# EAGLE design Squirco Logic v1.0 (EAGLE 6.5.0)
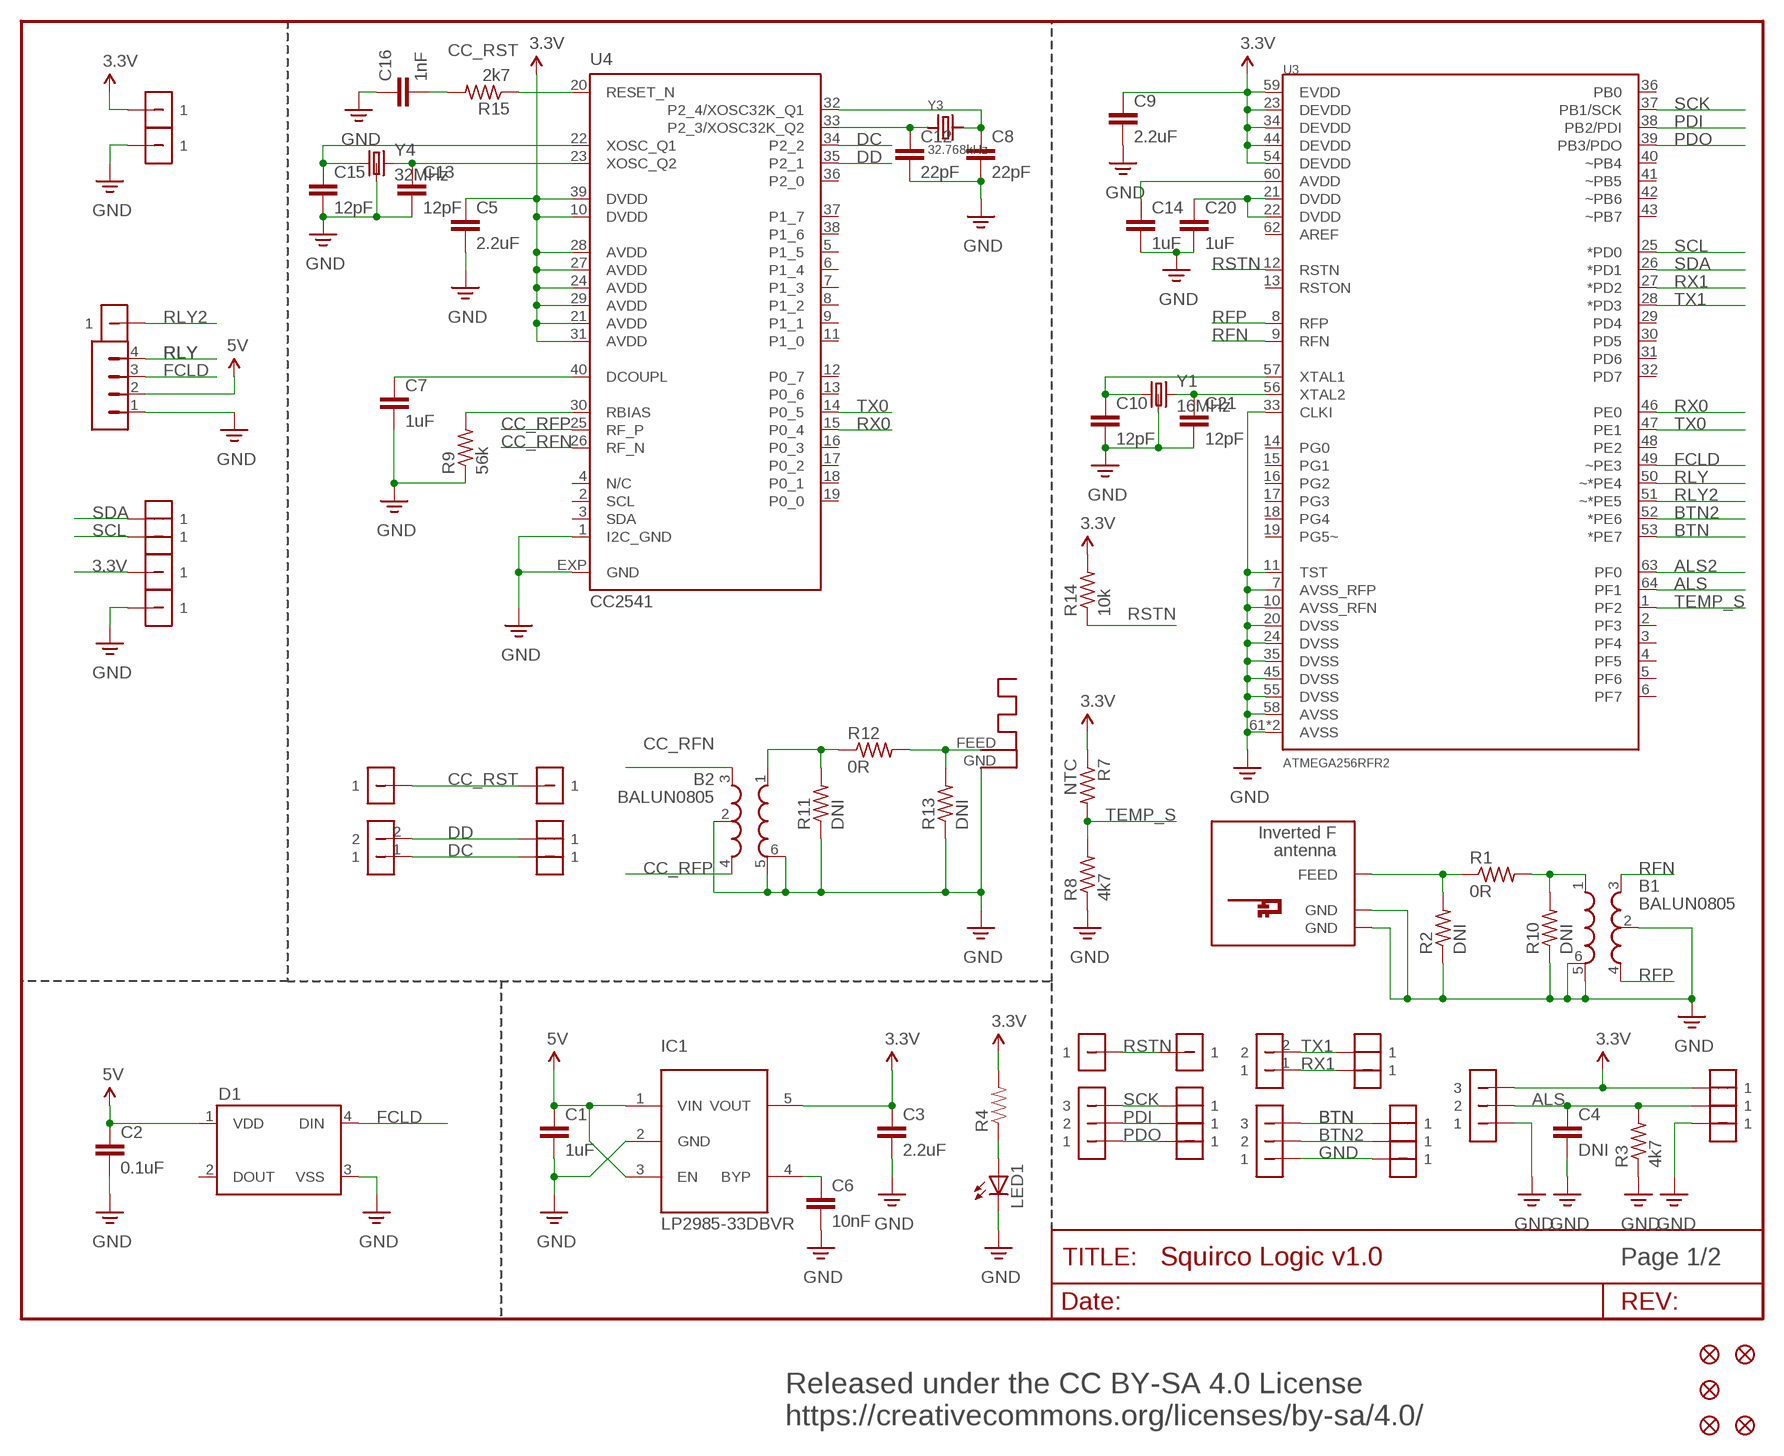
[diagram p0: schematic, sheet 1]

## Parts
ANT1  ANTENNA  [RN-ANT]
ANT2  INVERTED_F_ANTENNA+5  [DN007+5]
B1  BALUN0805  [BALUN-2-4GHZ]
B2  BALUN0805  [BALUN-2-4GHZ]
C1  1uF  CAP0603-CAP  [0603-CAP]
C2  0.1uF  CAP0603-CAP  [0603-CAP]
C3  2.2uF  CAP0603-CAP  [0603-CAP]
C4  DNI  CAP0603-CAP  [0603-CAP]
C5  2.2uF  CAP0603-CAP  [0603-CAP]
C6  10nF  CAP0603-CAP  [0603-CAP]
C7  1uF  CAP0603-CAP  [0603-CAP]
C8  22pF  CAP0402-CAP  [0402-CAP]
C9  2.2uF  CAP0603-CAP  [0603-CAP]
C10  12pF  CAP0402-CAP  [0402-CAP]
C12  22pF  CAP0402-CAP  [0402-CAP]
C13  12pF  CAP0402-CAP  [0402-CAP]
C14  1uF  CAP0603-CAP  [0603-CAP]
C15  12pF  CAP0402-CAP  [0402-CAP]
C16  1nF  CAP0603-CAP  [0603-CAP]
C20  1uF  CAP0603-CAP  [0603-CAP]
C21  12pF  CAP0402-CAP  [0402-CAP]
D1  WS2812B  [WS2812B]
FID1  FIDUCIALUFIDUCIAL  [MICRO-FIDUCIAL]
FID2  FIDUCIALUFIDUCIAL  [MICRO-FIDUCIAL]
FID3  FIDUCIALUFIDUCIAL  [MICRO-FIDUCIAL]
FID5  FIDUCIALUFIDUCIAL  [MICRO-FIDUCIAL]
FID6  FIDUCIALUFIDUCIAL  [MICRO-FIDUCIAL]
IC1  LP2985-33DBVR  LP298XS  [SOT23-5L]
JP1  M02  [M02]
LED1  LEDCHIP-LED0805  [CHIP-LED0805]
R1  0R  R-US_R0402  [R0402]
R2  DNI  R-US_R0402  [R0402]
R3  4k7  R-US_R0603  [R0603]
R4  RESISTOR0603  [0603-RES]
R7  NTC  R-US_R0402  [R0402]
R8  4k7  R-US_R0603  [R0603]
R9  56k  R-US_R0603  [R0603]
R10  DNI  R-US_R0402  [R0402]
R11  DNI  R-US_R0402  [R0402]
R12  0R  R-US_R0402  [R0402]
R13  DNI  R-US_R0402  [R0402]
R14  10k  R-US_R0603  [R0603]
R15  2k7  R-US_R0603  [R0603]
U3  ATMEGA256RFR2  [QFN-64]
U4  CC2541  [RHA_S-PVQFN-N40]
U$4  M03  [M03]
U$5  S04-4MM  [S04-4MM]
U$6  M03  [M03]
U$7  M01  [M01]
U$8  M01  [M01]
U$9  M02  [M02]
U$10  S01C-4MM  [S01C-4MM]
U$11  S01C-4MM  [S01C-4MM]
U$12  S01C-4MM  [S01C-4MM]
U$13  S01C-4MM  [S01C-4MM]
U$14  S01C-4MM  [S01C-4MM]
U$15  S01C-4MM  [S01C-4MM]
U$16  S01C-4MM  [S01C-4MM]
U$17  S01C-4MM  [S01C-4MM]
U$18  S01C-4MM  [S01C-4MM]
U$19  S01C-4MM  [S01C-4MM]
U$20  S01C-4MM  [S01C-4MM]
U$21  S01C-4MM  [S01C-4MM]
U$22  S01C-4MM  [S01C-4MM]
U$23  S01C-4MM  [S01C-4MM]
U$24  S01C-4MM  [S01C-4MM]
U$25  M03  [M03]
U$26  S01C-4MM  [S01C-4MM]
U$27  S01C-4MM  [S01C-4MM]
U$30  S01C-4MM  [S01C-4MM]
U$31  S01C-4MM  [S01C-4MM]
U$32  S01-4MM  [S01-4MM]
U$33  S01-4MM  [S01-4MM]
U$34  S01C-4MM  [S01C-4MM]
Y1  16MHz  CRYSTALABM10  [CRYSTAL-SMD-2.5X2-ABM10]
Y3  32.768kHz  CRYSTAL.ABS07  [ABS07]
Y4  32MHz  CRYSTALABM10  [CRYSTAL-SMD-2.5X2-ABM10]

## Nets
3.3V: C3.1 C5.1 C9.1 IC1.5(VOUT) R4.2 R7.1 R14.2 U3.23(DEVDD) U3.34(DEVDD) U3.44(DEVDD) U3.54(DEVDD) U3.59(EVDD) U4.10(DVDD) U4.21(AVDD) U4.24(AVDD) U4.27(AVDD) U4.28(AVDD) U4.29(AVDD) U4.31(AVDD) U4.39(DVDD) U$20.P$1 U$25.3 U$26.P$1 U$30.P$1
5V: C1.1 C2.1 D1.1(VDD) IC1.1(VIN) IC1.3(EN) U$5.2
ALS: C4.1 R3.2 U3.64(PF1) U$25.2 U$31.P$1
ALS2: U3.63(PF0)
BTN: U3.53(*PE7) U$6.3 U$22.P$1
BTN2: U3.52(*PE6) U$6.2 U$23.P$1
CC_RFN: B2.3 U4.26(RF_N)
CC_RFP: B2.4 U4.25(RF_P)
CC_RST: C16.2 R15.2 U$8.1 U$17.P$1
DC: U4.34(P2_2) U$9.1 U$19.P$1
DD: U4.35(P2_1) U$9.2 U$18.P$1
FCLD: D1.4(DIN) U3.49(~PE3) U$5.3
GND: ANT1.GND ANT2.GND ANT2.GND@1(GND) B1.2 B1.5 B1.6 B2.2 B2.5 B2.6 C1.2 C2.2 C3.2 C4.2 C5.2 C6.2 C7.2 C8.2 C9.2 C10.2 C12.2 C13.2 C14.2 C15.2 C16.1 C20.2 C21.2 D1.3(VSS) IC1.2(GND) LED1.C R2.1 R3.1 R8.1 R9.1 R10.1 R11.1 R13.1 U3.7(AVSS_RFP) U3.10(AVSS_RFN) U3.11(TST) U3.20(DVSS) U3.24(DVSS) U3.33(CLKI) U3.35(DVSS) U3.45(DVSS) U3.55(DVSS) U3.58(AVSS) U3.61(AVSS) U3.PADDLE(AVSS) U4.1(I2C_GND) U4.EXP(GND) U$5.1 U$6.1 U$21.P$1 U$25.1 U$27.P$1 U$32.P$1 U$33.P$1 Y1.P$2(GND) Y1.P$4(GND) Y4.P$2(GND) Y4.P$4(GND)
N$1: C10.1 U3.57(XTAL1) Y1.P$1
N$2: C21.1 U3.56(XTAL2) Y1.P$3
N$3: LED1.A R4.1
N$5: ANT2.FEED R1.1 R2.2
N$6: C6.1 IC1.4(BYP)
N$7: C7.1 U4.40(DCOUPL)
N$8: C20.1 U3.21(DVDD) U3.22(DVDD)
N$9: C14.1 U3.60(AVDD)
N$11: R9.2 U4.30(RBIAS)
N$14: B2.1 R11.2 R12.1
N$15: ANT1.FEED R12.2 R13.2
N$16: C15.1 U4.22(XOSC_Q1) Y4.P$1
N$18: C13.1 U4.23(XOSC_Q2) Y4.P$3
N$19: C8.1 U4.32(P2_4/XOSC32K_Q1) Y3.2
N$20: B1.1 R1.2 R10.2
N$21: C12.1 U4.33(P2_3/XOSC32K_Q2) Y3.1
N$24: R15.1 U4.20(RESET_N)
PDI: U3.38(PB2/PDI) U$4.2 U$13.P$1
PDO: U3.39(PB3/PDO) U$4.1 U$14.P$1
RFN: B1.3 U3.9(RFN)
RFP: B1.4 U3.8(RFP)
RLY: U3.50(~*PE4) U$5.4
RLY2: U3.51(~*PE5) U$34.P$1
RSTN: R14.1 U3.12(RSTN) U$7.1 U$11.P$1
RX0: U3.46(PE0) U4.15(P0_4)
RX1: JP1.1 U3.27(*PD2) U$16.P$1
SCK: U3.37(PB1/SCK) U$4.3 U$12.P$1
SCL: U3.25(*PD0) U$24.P$1
SDA: U3.26(*PD1) U$10.P$1
TEMP_S: R7.2 R8.2 U3.1(PF2)
TX0: U3.47(PE1) U4.14(P0_5)
TX1: JP1.2 U3.28(*PD3) U$15.P$1
Unconnected: D1.2(DOUT) U3.2(PF3) U3.3(PF4) U3.4(PF5) U3.5(PF6) U3.6(PF7) U3.13(RSTON) U3.14(PG0) U3.15(PG1) U3.16(PG2) U3.17(PG3) U3.18(PG4) U3.19(PG5~) U3.29(PD4) U3.30(PD5) U3.31(PD6) U3.32(PD7) U3.36(PB0) U3.40(~PB4) U3.41(~PB5) U3.42(~PB6) U3.43(~PB7) U3.48(PE2) U3.62(AREF) U4.2(SCL) U4.3(SDA) U4.5(P1_5) U4.6(P1_4) U4.7(P1_3) U4.8(P1_2) U4.9(P1_1) U4.11(P1_0) U4.12(P0_7) U4.13(P0_6) U4.16(P0_3) U4.17(P0_2) U4.18(P0_1) U4.19(P0_0) U4.36(P2_0) U4.37(P1_7) U4.38(P1_6)

## Notes on the sheet
- Page 1/2
- Released under the CC BY-SA 4.0 License
  https://creativecommons.org/licenses/by-sa/4.0/

## Power pins joined to a net without a drawn wire
N/C: U4.4(N/C)

## Library data of the parts
ANT1 = adafruit:ANTENNA
ANT2 = DF007:INVERTED_F_ANTENNA: 2.4GHz Inverted F Antenna Based on TI Design Note DN007
B1 B2 = Pinoccio2:BALUN: Johanson 2450BM15A001
C1-C10 C12-C16 C20 C21 = SparkFun-Capacitors:CAP: Capacitor Standard 0603 ceramic capacitor, and 0.1" leaded capacitor.
D1 = SparkFun-LED:WS2812B: WS2812B - Intelligent control LED integrated light source Technical Specifications: Power Supply Voltage (VDD): 3.5 to 5.3 V Input Voltage (VI): -0.5 to VDD+0.5 V Operating Junction Temperature (Topt): -25°C to +80°C Storage Temperature Range (Tstg): -55°C to +150°C
FID1-FID3 FID5 FID6 = SparkFun-Aesthetics:FIDUCIAL: Fiducial Alignment Points Various fiducial points for machine vision alignment.
IC1 = adafruit:LP298X
JP1 U$9 = pinhead-half:M02
LED1 = adafruit:LED: LED OSRAM: - CHIPLED LG R971, LG N971, LY N971, LG Q971, LY Q971, LO R971, LY R971 LH N974, LH R974 LS Q976, LO Q976, LY Q976 LO Q996 - Hyper CHIPLED LW Q18S LB Q993, LB Q99A, LB R99A - SideLED LS A670, LO A670, LY A670, LG A670, LP A670 LB A673, LV A673, LT A673, LW A673 LH A674 LY A675 LS A676, LA A676, LO A676, LY A676, LW A676 LS A679, LY A679, LG A679 - Hyper Micro SIDELED® LS Y876, LA Y876, LO Y876, LY Y876 LT Y87S - SmartLED LW L88C, LW L88S LB L89C, LB L89S, LG L890 LS L89K, LO L89K, LY L89K LS L896, LA L896, LO L896, LY L896 - TOPLED LS T670, LO T670, LY T670, LG T670, LP T670 LSG T670, LSP T670, LSY T670, LOP T670, LYG T670 LG T671, LOG T671, LSG T671 LB T673, LV T673, LT T673, LW T673 LH T674 LS T676, LA T676, LO T676, LY T676, LB T676, LH T676, LSB T676, LW T676 LB T67C, LV T67C, LT T67C, LS T67K, LO T67K, LY T67K, LW E67C LS E67B, LA E67B, LO E67B, LY E67B, LB E67C, LV E67C, LT E67C LW T67C LS T679, LY T679, LG T679 LS T770, LO T770, LY T770, LG T770, LP T770 LB T773, LV T773, LT T773, LW T773 LH T774 LS E675, LA E675, LY E675, LS T675 LS T776, LA T776, LO T776, LY T776, LB T776 LHGB T686 LT T68C, LB T68C - Hyper Mini TOPLED® LB M676 - Mini TOPLED Santana® LG M470 LS M47K, LO M47K, LY M47K Source: http://www.osram.convergy.de/
R1-R3 R7-R15 = adafruit:R-US_: RESISTOR, American symbol
R4 = SparkFun-Resistors:RESISTOR: Resistor Basic schematic elements and footprints for 0603, 1206, and PTH resistors.
U3 = Pinoccio:ATMEGA256RFR2
U4 = ST-CC254X:CC2541: CC2541 Bluetooth Smart SoC
U$4 U$6 U$25 = pinhead-half:M03
U$5 = pinhead-half:S04-4MM
U$7 U$8 = pinhead-half:M01
U$10-U$24 U$26 U$27 U$30 U$31 U$34 = pinhead-half:S01C-4MM
U$32 U$33 = pinhead-half:S01-4MM
Y1 Y4 = Pinoccio:CRYSTAL: Crystals Various standard crystals. Proven footprints. Spark Fun Electronics SKU : COM-00534
Y3 = ABRACON:CRYSTAL

## Net classes
1 Tline: width 0.003 mm, drill 0.33 mm
2 120v Mains 5A: clearance 1.27 mm

## Board
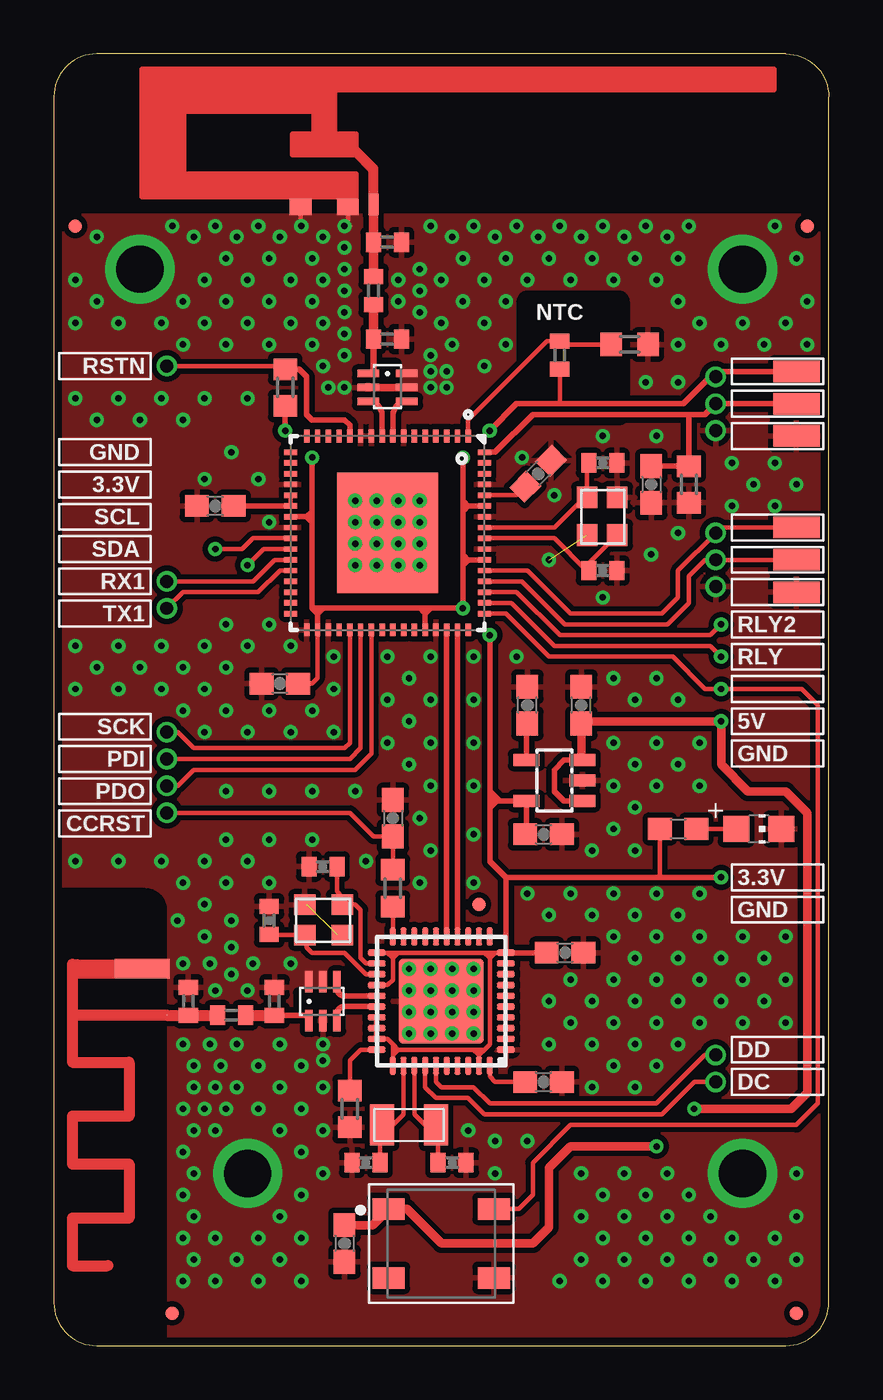
[diagram p1: board, top side]
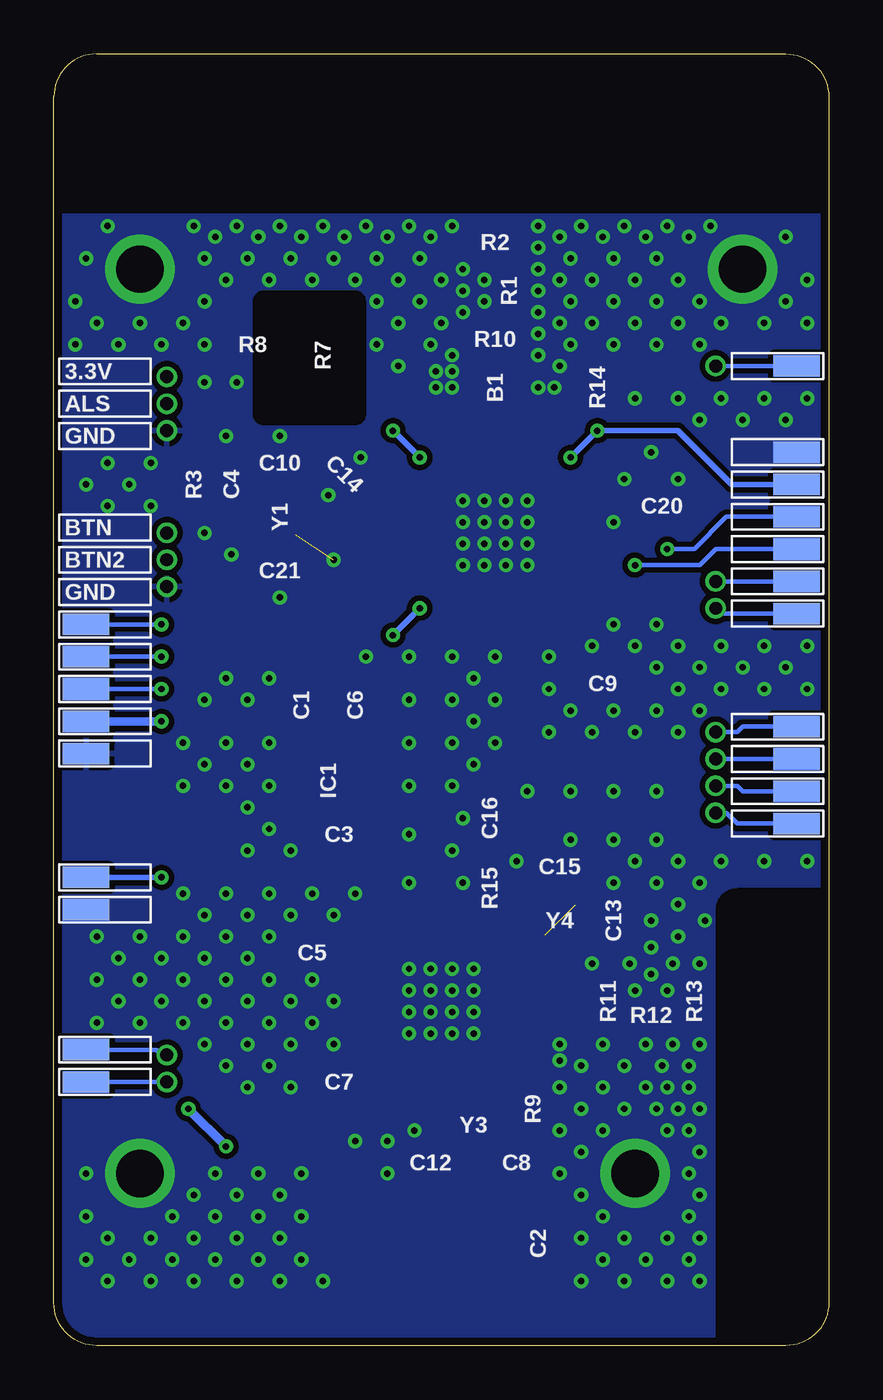
[diagram p2: board, bottom side, seen from below]

Size 36 x 60 mm. Coordinates in mm from the lower left corner, seen from the top.
Outline: 2,0 34,0 arc90 36,2 36,58 arc90 34,60 2,60 arc90 0,58 0,2 arc90 2,0
Copper layers (1*16): Top 0.0356mm / dielectric 1.5011mm / Bottom 0.0356mm
Design rules "LaenPCBOrder *": minimum track width 6mil, minimum drill 0.3mm, track to track 6mil, track to pad 6mil, pad to pad 6mil, via to via 6mil, smd to smd 6mil, copper to edge 15mil, drill to drill 6mil, minimum pad ring 7mil, minimum via ring 7mil, stop-mask expansion 3mil, vias tented up to drill 15mil, thermal gap 10mil

### Footprints (pad centres in the part's own frame; a part is rotated, then mirrored left to right if it is on the bottom)
RN-ANT = smd 0.025 x 0.025: FEED 0,0 | smd 2.54 x 0.889: GND 1.143,-2.159
DN007+5 = smd 0.46 x 1: FEED -0.003,0.502 | smd 1.01 x 0.74: GND -3.382,0.372; GND@1 -1.188,0.372
BALUN-2-4GHZ = smd 0.35 x 1: 1 -0.65,-0.9; 2 0,-0.9; 3 0.65,-0.9; 4 0.65,0.9; 5 0,0.9; 6 -0.65,0.9
0603-CAP = smd 1.1 x 1: 1 -0.85,0; 2 0.85,0
0402-CAP = smd 0.7 x 0.9: 1 -0.65,0; 2 0.65,0
WS2812B = smd 1.5 x 1: 1 -2.45,1.6; 2 -2.45,-1.6; 3 2.45,-1.6; 4 2.45,1.6
MICRO-FIDUCIAL = smd 0.635 x 0.635: 1 0,0
SOT23-5L = smd 0.55 x 1.2: 1 -0.95,-1.3; 2 0,-1.3; 3 0.95,-1.3; 4 0.95,1.3; 5 -0.95,1.3
M02 = drill 0.6: 1 0,0; 2 0,1.25
CHIP-LED0805 = smd 1.2 x 1.2: A 0,-1.05; C 0,1.05
R0402 = smd 0.7 x 0.9: 1 -0.65,0; 2 0.65,0
R0603 = smd 1 x 1.1: 1 -0.85,0; 2 0.85,0
0603-RES = smd 1.1 x 1: 1 -0.85,0; 2 0.85,0
QFN-64 = smd 0.6 x 0.25: 1 -4.5,3.75; 2 -4.5,3.25; 3 -4.5,2.75; 4 -4.5,2.25; 5 -4.5,1.75; 6 -4.5,1.25; 7 -4.5,0.75; 8 -4.5,0.25; 9 -4.5,-0.25; 10 -4.5,-0.75; 11 -4.5,-1.25; 12 -4.5,-1.75; 13 -4.5,-2.25; 14 -4.5,-2.75; 15 -4.5,-3.25; 16 -4.5,-3.75; 33 4.5,-3.75; 34 4.5,-3.25; 35 4.5,-2.75; 36 4.5,-2.25; 37 4.5,-1.75; 38 4.5,-1.25; 39 4.5,-0.75; 40 4.5,-0.25; 41 4.5,0.25; 42 4.5,0.75; 43 4.5,1.25; 44 4.5,1.75; 45 4.5,2.25; 46 4.5,2.75; 47 4.5,3.25; 48 4.5,3.75 | smd 0.25 x 0.6: 17 -3.75,-4.5; 18 -3.25,-4.5; 19 -2.75,-4.5; 20 -2.25,-4.5; 21 -1.75,-4.5; 22 -1.25,-4.5; 23 -0.75,-4.5; 24 -0.25,-4.5; 25 0.25,-4.5; 26 0.75,-4.5; 27 1.25,-4.5; 28 1.75,-4.5; 29 2.25,-4.5; 30 2.75,-4.5; 31 3.25,-4.5; 32 3.75,-4.5; 49 3.75,4.5; 50 3.25,4.5; 51 2.75,4.5; 52 2.25,4.5; 53 1.75,4.5; 54 1.25,4.5; 55 0.75,4.5; 56 0.25,4.5; 57 -0.25,4.5; 58 -0.75,4.5; 59 -1.25,4.5; 60 -1.75,4.5; 61 -2.25,4.5; 62 -2.75,4.5; 63 -3.25,4.5; 64 -3.75,4.5 | smd 5.588 x 4.699: PADDLE 0,0
RHA_S-PVQFN-N40 = smd 0.85 x 0.3: 1 -3,2.25; 2 -3,1.75; 3 -3,1.25; 4 -3,0.75; 5 -3,0.25; 6 -3,-0.25; 7 -3,-0.75; 8 -3,-1.25; 9 -3,-1.75; 10 -3,-2.25; 21 3,-2.25; 22 3,-1.75; 23 3,-1.25; 24 3,-0.75; 25 3,-0.25; 26 3,0.25; 27 3,0.75; 28 3,1.25; 29 3,1.75; 30 3,2.25 | smd 0.3 x 0.85: 11 -2.25,-3; 12 -1.75,-3; 13 -1.25,-3; 14 -0.75,-3; 15 -0.25,-3; 16 0.25,-3; 17 0.75,-3; 18 1.25,-3; 19 1.75,-3; 20 2.25,-3; 31 2.25,3; 32 1.75,3; 33 1.25,3; 34 0.75,3; 35 0.25,3; 36 -0.25,3; 37 -0.75,3; 38 -1.25,3; 39 -1.75,3; 40 -2.25,3 | smd 3.937 x 3.937: EXP 0,0
M03 = drill 0.6: 1 0,-1.25; 2 0,0; 3 0,1.25
S04-4MM = smd 2.15 x 1: 1 0,0; 2 0,1.5; 3 0,3; 4 0,4.5
M01 = drill 0.6: 1 0,0
S01C-4MM = smd 2.15 x 1: P$1 0,0
S01-4MM = smd 2.15 x 1: P$1 0,0
CRYSTAL-SMD-2.5X2-ABM10 = smd 1 x 0.95: P$1 -0.9,-0.725; P$2 0.85,-0.725; P$3 0.85,0.675; P$4 -0.9,0.675
ABS07 = smd 1.1 x 1.9: 1 -1.25,0; 2 1.25,0

### Placement (x,y rotation side)
ANT1  5.25,15.35 180 top
ANT2  14.85,52.5 0 top
B1  15.5,44.5 270 top
B2  12.5,16 0 top
C1  24.5,29.75 90 top
C2  13.5,4.75 270 top
C3  22.75,23.75 0 top
C4  27.75,40 270 top
C5  23.75,18.25 0 top
C6  22,29.75 90 top
C7  22.75,12.25 0 top
C8  14.5,8.5 180 top
C9  10.5,30.75 180 top
C10  25.5,41 0 top
C12  18.5,8.5 0 top
C13  10,19.75 90 top
C14  22.5,40.5 45 top
C15  12.5,22.25 180 top
C16  15.75,24.5 270 top
C20  7.5,39 180 top
C21  25.5,36 0 top
D1  18,4.75 0 top
FID1  1,52 0 top
FID2  35,52 0 top
FID3  34.5,1.5 0 top
FID5  5.5,1.5 0 top
FID6  19.75,20.5 0 top
IC1  23.25,26.25 90 top
JP1  5.25,35.5 180 top
LED1  32.75,24 270 top
R1  14.85,49 270 top
R2  15.5,51.25 180 top
R3  29.5,40 90 top
R4  29,24 180 top
R7  23.5,46 90 top
R8  26.75,46.5 180 top
R9  13.75,11 90 top
R10  15.5,46.75 180 top
R11  10.25,16 270 top
R12  8.25,15.35 180 top
R13  6.25,16 270 top
R14  10.75,44.5 270 top
R15  15.75,21.25 90 top
U3  15.5,37.75 270 top
U4  18,16 180 top
U$4  5.25,27.25 0 top
U$5  34.5,27.5 0 bottom
U$6  30.75,36.5 0 top
U$7  5.25,45.5 0 top
U$8  5.25,24.75 0 top
U$9  30.75,12.25 0 top
U$10  1.5,37 180 bottom
U$11  1.5,45.5 180 bottom
U$12  1.5,28.75 180 bottom
U$13  1.5,27.25 180 bottom
U$14  1.5,25.75 180 bottom
U$15  1.5,34 180 bottom
U$16  1.5,35.5 180 bottom
U$17  1.5,24.25 180 bottom
U$18  34.5,13.75 0 bottom
U$19  34.5,12.25 0 bottom
U$20  34.5,21.75 0 bottom
U$21  34.5,20.25 0 bottom
U$22  34.5,38 180 top
U$23  34.5,36.5 180 top
U$24  1.5,38.5 180 bottom
U$25  30.75,43.75 0 top
U$26  1.5,40 180 bottom
U$27  1.5,41.5 180 bottom
U$30  34.5,45.25 180 top
U$31  34.5,43.75 180 top
U$32  34.5,42.25 180 top
U$33  34.5,35 180 top
U$34  34.5,33.5 0 bottom
Y1  25.5,38.5 270 top
Y3  16.5,10.25 180 top
Y4  12.5,19.75 180 top

### Tracks (layer width: path | path; a pad name or v marks a point on that pad's centre or on a via)
3.3V  (via drill 0.3)
  Top 0.2: U4.10 20.5,18.25 | 20.25,18 20.25,14 20,13.75 | 20,13.75 19.75,13.75 | 19.75,13.75 19.75,13.5 | 19.75,13.5 U4.39 | U4.29 15.5,14.25 15.75,14 | 15.75,14 15.75,13.75 | U4.31 15.75,13.5 | 15.75,13.5 15.75,13.75 | 15.75,13.75 16,13.75 | 16,13.75 19.5,13.75 | 19.5,13.75 19.75,13.75 | U4.21 15.5,18.25 | 15.5,18.25 15.75,18.25 | 15.75,18.25 16,18.25 | 16,18.25 20,18.25 | 20.25,18 20.5,18.25 | 20.25,18 20,18.25 | U4.24 15.5,16.75 15.75,17 15.75,18 | 15.75,18 15.75,18.25 | 20,18.25 20.25,18.25 | 20.25,18.25 20.5,18.25 | 20.25,18.25 20.25,18 | 19.75,13.5 19.5,13.75 | 19.75,13.5 20,13.75 | 15.75,14 16,13.75 | 16,13.75 15.75,13.5 | 15.5,18.25 15.75,18 | 15.75,18 16,18.25 | U3.34 12.25,31 12,30.75 C9.1 | R7.1 23.5,43.75 | R4.2 28.15,21.85 28.25,21.75
  Top 0.25: 19,36.25 v19,34.25 17.5,34.25 | 19,36.25 19.25,36.5 | 19.25,36.5 U3.54 | U3.59 19.25,39 | 19.25,39 19,38.75 | 19,38.75 19,36.75 | 19,36.75 19.25,36.5 | 17.5,34.25 17.25,34 | 17.25,34 U3.44 | U3.34 12.25,34 | 12.25,34 12.5,34.25 | 12.5,34.25 17,34.25 | 17,34.25 17.25,34 | U3.23 11.75,38.5 | 11.75,38.5 12,38.25 | 12,38.25 12,34.25 | 12,34.25 12.25,34 | R14.2 v10.75,42.5 | v12,41.25 12,38.75 | 12,38.75 11.75,38.5 | C5.1 U4.10 21,21.75 | 12.5,34.25 12,34.25 | 12,38.75 12,38.25 | 17,34.25 17.5,34.25 | 19,36.25 19,36.75 | v20.25,33 20.25,25.75 | 20.25,25.75 20.5,25.5 | 20.5,25.5 20.62,25.38 | 20.62,25.38 20.7,25.3 IC1.5 21.95,23.8 C3.1 | 21,21.75 20.25,22.5 20.25,25 | 20.25,25 20.62,25.38 | 20.25,25.75 20.25,25.25 | 20.25,25 20.25,25.25 | 20.25,25.25 20.5,25.5 | v31,21.75 28.25,21.75 21,21.75 | 19.25,39 19,39.25 | 19,39.25 v19,41.25 | 19,39.25 19,38.75 | v20.25,42.5 21.5,43.75 23.5,43.75 29.25,43.75 30.5,45 U$25.3 31,45.25 U$30.P$1
  Top 0.254: U4.29 U4.28 U4.27
  Bottom 0.25: v12,41.25 v10.75,42.5 7,42.5 4.5,40 U$26.P$1 | U$20.P$1 v31,21.75 | v19,41.25 v20.25,42.5
  Bottom 0.3: v20.25,33 v19,34.25
5V  (via drill 0.3)
  Top 0.25: IC1.1 23.7,25.3 23.25,25.75 23.25,26.75 23.7,27.2 IC1.3 24.5,27.25 | 24.6,29 C1.1
  Top 0.4: C1.1 24.5,27.25 | 24.6,29 v31,29 31,27 32.25,25.75 34,25.75 35,24.75 35,11.75 34.25,11 v29.75,11 | 13.4,5.5 C2.1 14.8,5.6 D1.1 16.4,6.35 18,4.75 22.25,4.75 23,5.5 23,8.25 24,9.25 v28,9.25
  Bottom 0.4: U$5.2 v31,29 | v29.75,11 v28,9.25
ALS
  Top 0.25: U3.64 20.5,41.5 22.25,43.25 29.5,43.25 | 29.5,43.25 30.25,43.25 U$25.2 U$31.P$1 | 29.5,43.25 R3.2 C4.1
BTN
  Top 0.2: U3.53 22,36 24,34 28.25,34 29,34.75 29,36 U$6.3 31,38 U$22.P$1
BTN2
  Top 0.2: U3.52 21.75,35.5 23.75,33.5 28.5,33.5 29.5,34.5 29.5,35.75 30.25,36.5 U$6.2 U$23.P$1
CC_RFN
  Top 0.25: B2.3 13.15,15.4 arc-90 13.5,15.75 U4.26
CC_RFP
  Top 0.25: B2.4 13.15,16.6 arc90 13.5,16.25 U4.25
CC_RST
  Top 0.2: R15.2 C16.2 14.85,23.65 13.75,24.75 U$8.1
  Bottom 0.2: U$8.1 4.75,24.75 4.25,24.25 U$17.P$1
CUT
  cutout Top: 5.25,0 5.25,20.25 arc90 4.25,21.25 -1,21.25 -1,0
  cutout Bottom: -2,21.25 4.25,21.25 arc-90 5.25,20.25 5.25,0 -2,0
  cutout Top: 17.26,38.56 17.26,40.34 17.14,40.47 15.74,40.47 15.74,38.56
DC
  Top 0.2: U4.34 17.25,12 17.75,11.5 19.25,11.5 20,10.75 28.25,10.75 29.75,12.25 U$9.1
  Bottom 0.2: U$9.1 U$19.P$1
DD
  Top 0.2: U4.35 17.75,12.25 18,12 19.5,12 20.25,11.25 28,11.25 30.25,13.5 U$9.2
  Bottom 0.2: U$9.2 31,13.5 31.25,13.75 U$18.P$1
FCLD  (via drill 0.3)
  Top 0.2: U3.49 21,34 23,32 28.75,32 30.25,30.5 v31,30.5 34.75,30.5 35.5,29.75 35.5,11.25 34.5,10.25 24,10.25 22.25,8.5 22.25,7 21.6,6.35 D1.4
  Bottom 0.2: v31,30.5 U$5.3 35.25,30.5
GND  (via drill 0.3, 2.2)  (2 unrouted)
  Top 0: U3.PADDLE arc-90 v15,37.25
  Top 0.2: Y4.P$2 11.78,20.48 | Y4.P$4 13.18,19.07 | ANT2.GND 11.47,52.03 v11.5,52 | ANT2.GND@1 13.66,52.09 13.75,52 | U4.EXP v17.5,15.5
  Top 0.25: B1.2 15,44.5
  Top 0.35: 15,44.5 16,44.5
  other vias: 4,50 32,50 9,8 17.5,44.5 18.25,44.5 18.25,45.25 17.5,45.25 13.5,44.5 12.75,44.5 17.5,16.5 17.5,17.5 16.5,16.5 16.5,17.5 18.5,17.5 18.5,16.5 19.5,16.5 19.5,17.5 18.5,15.5 16.5,15.5 19.5,15.5 19.5,14.5 18.5,14.5 17.5,14.5 16.5,14.5 32,8 15,38.25 14,38.25 14,39.25 15,39.25 14,37.25 14,36.25 15,36.25 16,39.25 17,39.25 17,38.25 17,37.25 17,36.25 16,36.25 16,37.25 16,38.25 13.5,52 13.5,51 13.5,50 13.5,49 13.5,48 13.5,47 13.5,46 12.5,45.5 12,46.5 12,48.5 12,50.5 12.5,51.5 10.5,51.5 9.5,52 8.5,51.5 7.5,52 6.5,51.5 5.5,52 10,50.5 8,50.5 11,49.5 11,47.5 9,49.5 7,49.5 10,48.5 8,48.5 6,48.5 9,47.5 7,47.5 10,46.5 8,46.5 6,46.5 5,47.5 3,47.5 1,47.5 1,49.5 9,44 3,44 1,44 2,43 1,32.5 3,32.5 5,32.5 7,32.5 9,32.5 11,32.5 8,33.5 10,33.5 6,31.5 8,31.5 4,31.5 2,31.5 1,30.5 3,30.5 5,30.5 7,30.5 6,29.5 7,28.5 8,29.5 9,28.5 10,29.5 11,28.5 12,29.5 13,28.5 13,30.5 8,25.75 10,25.75 12,25.75 14,25.75 15.5,30 15.5,32 16.5,31 17.5,32 17.5,30 16.5,29 15.5,28 17,24.5 17,21.5 8,23.5 10,23.5 12,23.5 9,22.5 7,22.5 5,22.5 3,22.5 1,22.5 8,21.5 6,21.5 7,20.5 7,19 8.25,19.75 8.25,18.5 7.5,16.5 5.75,19.75 9,16.5 9.25,17.75 10.5,14 6,14 6.5,13 11.5,13 6.5,12 8.5,12 10.5,12 11.5,11 9.5,11 6,11 6.5,10 7.5,10 10.5,10 12.5,10 6,9 6.5,8 6,7 6.5,6 7.5,5 7.5,3 8.5,4 11.5,9 9.5,5 10.5,6 11.5,7 12.5,8 29,14 30,15 34.5,8 34.5,4 34.5,6 24.5,8 26.5,8 28.5,8 25.5,7 27.5,7 29.5,7 24.5,6 26.5,6 28.5,6 30.5,6 29.5,5 31.5,5 33.5,5 27.5,5 25.5,5 23.5,3 25.5,3 26.5,4 27.5,3 28.5,4 29.5,3 30.5,4 31.5,3 32.5,4 33.5,3 25,12 27,12 28,13 26,13 25,14 27,14 22,21 23,14 24,15 23,16 26,15 28,15 29,16 27,16 25,16 24,17 26,17 28,17 30,17 26,19 25,20 23,20 24,21 26,21 27,20 27,18 29,18 30,19 28,19 29,20 28,21 30,21 31,18 32,19 34,19 33,18 34,17 32,17 31,16 33,16 5,44 7,44 2,51.5 2,48.5 12.5,49.5 12.5,47.5 13,32 10,21.5 14.5,22.5 8.25,17.25 6,17.75 7.25,17.75 7.5,12 8,11 27,23 26,24 27,25 26,26 28,26 30,26 29,27 27,27 26,28 28,28 30,28 29,30 27,30 26,31 28,31 21.5,32 25,23 23,36.5 25.5,34.75 23.25,39.5 21.75,41.25 31.5,39 16,49.5 16,48.5 17,48 17,50 17,49 18,49.5 18,47.5 18.5,46.5 17.5,46 17.5,52 18.5,51.5 19.5,52 20.5,51.5 21.5,52 22.5,51.5 23.5,52 24.5,51.5 25.5,52 26.5,51.5 27.5,52 28.5,51.5 29.5,52 19,50.5 21,50.5 23,50.5 25,50.5 27,50.5 29,50.5 28,49.5 26,49.5 24,49.5 22,49.5 20,49.5 19,48.5 21,48.5 20,47.5 21,46.5 20,45.5 29,48.5 30,47.5 29,46.5 31,46.5 32,47.5 33,46.5 34,47.5 35,48.5 35,46.5 34.5,50.5 33.5,52 27.75,36.75 29,44.75 31.5,41 32.5,40 33.5,41 33.5,39 34.5,40 27.5,44.75 9.5,40.25 10,38.25 8.25,41.5 7,40.25 12.5,14 12.5,13.25 12.5,12 9.5,13 8.5,14 7.75,13 7.25,14 11,17.75 17.5,28 16.5,27 17.5,26 17.5,23 19.5,32 19.5,30 19.5,28 19.5,26 19.5,23.75 19.5,21.5 6.5,4 9.5,3 25.5,42.25 29,37.75 28,42.25 32,15 34,15 20.5,9.5 20.5,8 22,9.5 19.25,10 24.5,4 11.5,5 10.5,4 11.5,3 6,5 6,3 7,11 4,43 6,43
  pour Top (isolate 0.254): 37,52.5 -1,52.5 -1,-0.5 37,-0.5
  pour Bottom (isolate 0.254): -2,52.5 -1.75,-1 38.25,-1 38,52.5
N$1
  Top 0.2: C10.1 24.77,40.92 Y1.P$1 24.65,39.4 23.25,38 U3.57
N$2
  Top 0.2: Y1.P$3 26.15,37.65 24.85,36.35 C21.1 24.75,36 23.25,37.5 U3.56
N$3
  Top 0.2: R4.1 LED1.A
N$5
  Top 0.406: ANT2.FEED
  Top 0.45: R1.1 R2.2 ANT2.FEED
N$6
  Top 0.25: IC1.4 21.95,28.85 C6.1
N$7
  Top 0.2: C7.1 20.5,12.25 20.25,12.5 U4.40
N$8
  Top 0.203: U3.21 U3.22
  Top 0.25: U3.22 C20.1
N$9
  Top 0.2: C14.1 21.5,39.5 U3.60
N$10
  cutout Top: 21.5,43.25 21.5,48.5 arc-90 22,49 26.25,49 arc-90 26.75,48.5 26.75,43.25 arc-90 26.25,42.75 22,42.75 arc-90
N$11
  Top 0.2: R9.2 13.75,13.25 14.25,13.75 U4.30
N$12
  cutout Bottom: 21.5,43.25 21.5,48.5 arc-90 22,49 26.25,49 arc-90 26.75,48.5 26.75,43.25 arc-90 26.25,42.75 22,42.75 arc-90
N$13
  cutout Top: 11.25,20.75 13.75,20.75 13.75,18.75 11.25,18.75
N$14
  Top 0.25: R11.2 11.85,15.35 B2.1
  Top 0.5: R12.1 R11.2
N$15
  Top 0.5: ANT1.FEED R13.2 R12.2
N$16
  Top 0.2: U4.22 14.5,17.75 14.25,18 14.25,20.25 14,20.5 13.43,20.5 Y4.P$1 | 13.25,20.62 Y4.P$1 | C15.1 13.15,21.1 13.4,20.85 Y4.P$1
N$17
  cutout Top: 11.5,41.75 19.5,41.75 19.5,33.75 11.5,33.75
N$18
  Top 0.2: U4.23 14.5,17.25 13.5,18.25 12,18.25 11.75,18.5 11.75,18.98 Y4.P$3 10.03,19.07 C13.1
N$19
  Top 0.2: U4.32 16.25,10.75 15.75,10.25 Y3.2 15.15,10.15 C8.1
N$20
  Top 0.3: B1.1 14.85,45.2 R10.2
  Top 0.45: R1.2 R10.2
N$21
  Top 0.2: U4.33 16.75,10.75 17.25,10.25 Y3.1 17.85,10.15 C12.1
N$22
  cutout Top: 24.5,39.75 26.5,39.75 26.5,37.25 25.25,37.25 24.75,36.75 23.75,37.75 24.5,38.5
N$24
  Top 0.2: U4.20 R15.1
PDI
  Top 0.2: U3.38 14.25,27.75 13.75,27.25 U$4.2
  Bottom 0.2: U$4.2 U$13.P$1
PDO
  Top 0.2: U3.39 14.75,27.5 14,26.75 6.5,26.75 5.75,26 U$4.1
  Bottom 0.2: U$4.1 4.25,26 4,25.75 U$14.P$1
RFN
  Top 0.25: U3.9 15.25,43.2 arc90 B1.3
RFP
  Top 0.25: U3.8 15.75,43.2 arc-90 B1.4
RLY  (via drill 0.3)
  Top 0.2: U3.50 21.25,34.5 23.25,32.5 30.5,32.5 v31,32
  Bottom 0.2: v31,32 U$5.4
RLY2  (via drill 0.3)
  Top 0.2: U3.51 21.5,35 23.5,33 30.5,33 v31,33.5
  Bottom 0.2: v31,33.5 U$34.P$1
RSTN
  Top 0.2: U$7.1 10.6,45.5 R14.1
  Top 0.25: U3.12 13.75,42.75 13.5,43 12,43 11.75,43.25 11.75,45 11.4,45.35 R14.1
  Bottom 0.2: U$11.P$1 U$7.1
RX0
  Top 0.25: U3.46 U4.15
RX1
  Top 0.2: U3.27 10.25,36.5 9.25,35.5 JP1.1
  Bottom 0.2: JP1.1 U$16.P$1
SCK
  Top 0.2: U3.37 13.75,28 13.5,27.75 6.5,27.75 5.75,28.5 U$4.3
  Bottom 0.2: U$4.3 4.25,28.5 4,28.75 U$12.P$1
SCL  (via drill 0.3)
  Top 0.2: U3.25 9.25,37.5 8.75,37 v7.5,37
  Bottom 0.2: v7.5,37 6.25,37 4.75,38.5 U$24.P$1
SDA  (via drill 0.3)
  Top 0.2: U3.26 9.75,37 v9,36.25
  Bottom 0.2: v9,36.25 6,36.25 5.25,37 U$10.P$1
TEMP_S
  Top 0.2: U3.1 19.25,43 22.9,46.65 R7.2 23.65,46.5 R8.2
TX0
  Top 0.25: U3.47 U4.14
TX1
  Top 0.2: U3.28 10.5,36 9.5,35 6,35 JP1.2
  Bottom 0.2: JP1.2 5,34 U$15.P$1

### Text on the board
tPlace: NTC | RSTN | GND | 3.3V | SCL | SDA | RX1 | TX1 | RLY2 | RLY | SCK | 5V | GND | PDI | PDO | CCRST | 3.3V | GND | DD | DC
bPlace: R2 | R1 | R10 | R7 | R8 | 3.3V | R14 | B1 | ALS | GND | C10 | C14 | C4 | R3 | C20 | Y1 | BTN | C21 | BTN2 | GND | C9 | C6 | C1 | IC1 | C16 | C3 | C15 | R15 | C13 | Y4 | C5 | R13 | R11 | R12 | C7 | R9 | Y3 | C8 | C12 | C2
tValues: Released under the CC BY-SA 4.0 License / https://creativecommons.org/licenses/by-sa/4.0/
tStop: Copyright 2015 Squirco